# Altium schematic sheet camera.SchDoc
size A4; SheetNumber: 5; SheetTotal: 6
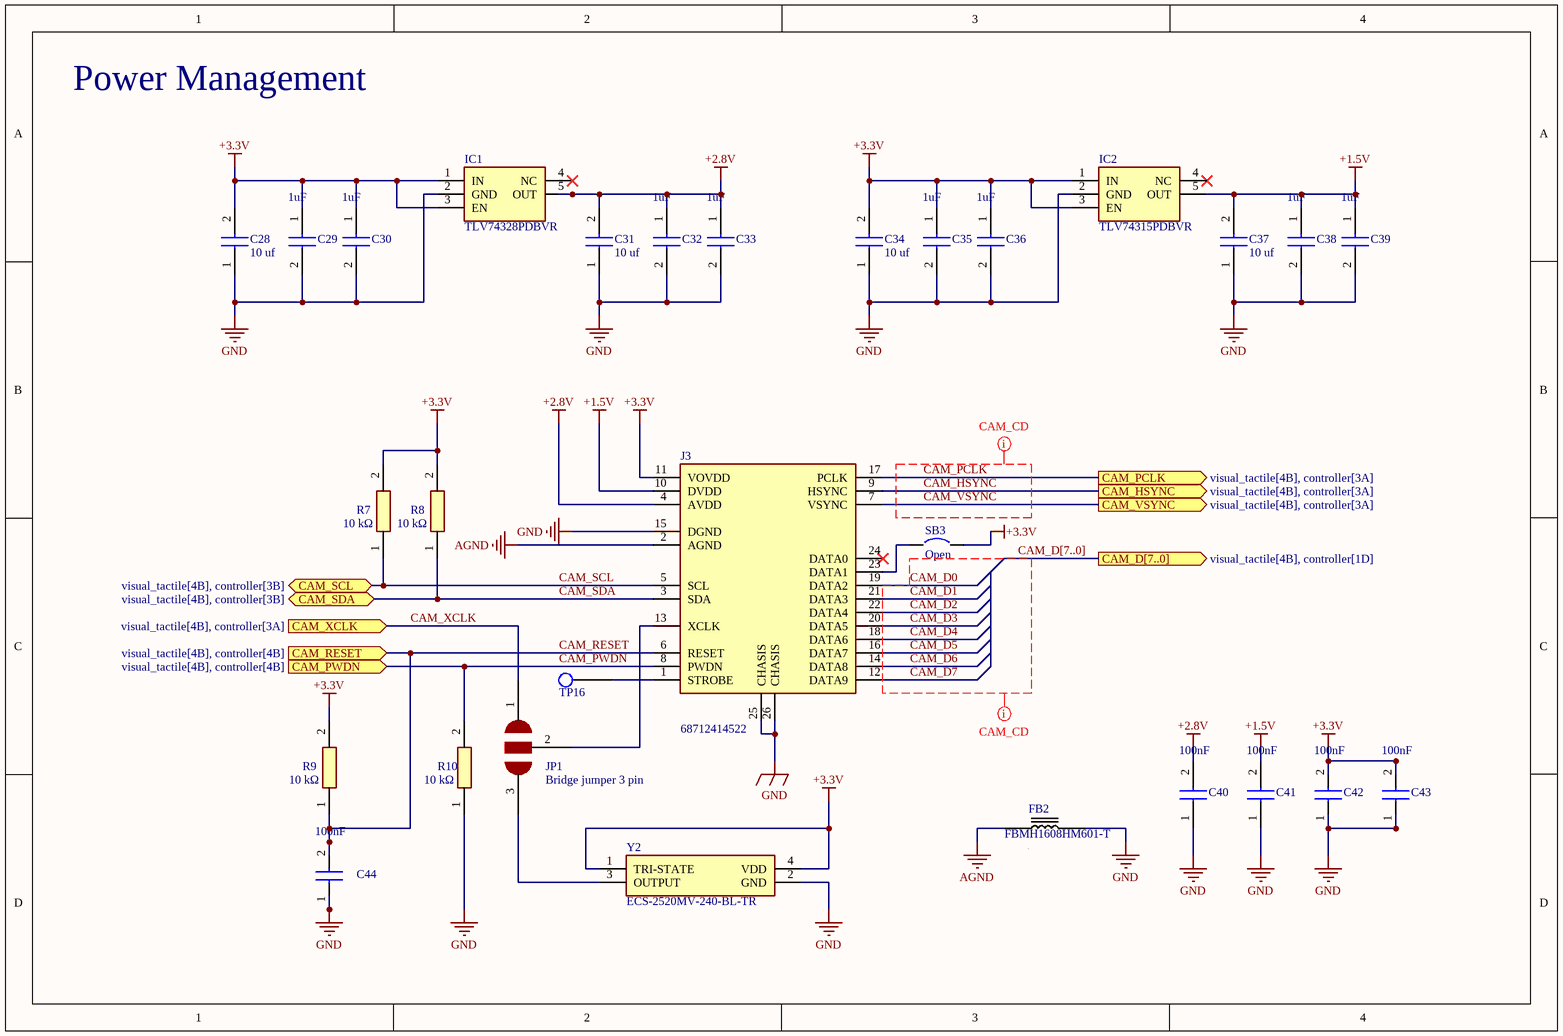
[diagram p0: camera.SchDoc]

## Parts
C28  10 uf  [CAPC1608X87N]
C29  value 1uF  [CAPC1608X87N]  (hidden comment: 0603ZD105KAT2A)
C30  value 1uF  [CAPC1608X87N]  (hidden comment: 0603ZD105KAT2A)
C31  10 uf  [CAPC1608X87N]
C32  value 1uF  [CAPC1608X87N]  (hidden comment: 0603ZD105KAT2A)
C33  value 1uF  [CAPC1608X87N]  (hidden comment: 0603ZD105KAT2A)
C34  10 uf  [CAPC1608X87N]
C35  value 1uF  [CAPC1608X87N]  (hidden comment: 0603ZD105KAT2A)
C36  value 1uF  [CAPC1608X87N]  (hidden comment: 0603ZD105KAT2A)
C37  10 uf  [CAPC1608X87N]
C38  value 1uF  [CAPC1608X87N]  (hidden comment: 0603ZD105KAT2A)
C39  value 1uF  [CAPC1608X87N]  (hidden comment: 0603ZD105KAT2A)
C40  value 100nF  [CAPC1608X87N]  (hidden comment: CGA3E2X7R1H104K080AA)
C41  value 100nF  [CAPC1608X87N]  (hidden comment: CGA3E2X7R1H104K080AA)
C42  value 100nF  [CAPC1608X87N]  (hidden comment: CGA3E2X7R1H104K080AA)
C43  value 100nF  [CAPC1608X87N]  (hidden comment: CGA3E2X7R1H104K080AA)
C44  value 100nF  [CAPC1608X87N]  (hidden comment: CGA3E2X7R1H104K080AA)
FB2  FBMH1608HM601-T  [BEADC1608X90N]
IC1  TLV74328PDBVR  [SOT95P280X145-5N]
IC2  TLV74315PDBVR  [SOT95P280X145-5N]
J3  68712414522  [68712414522]
JP1  Bridge jumper 3 pin  [Bridge jumper 3 pin]
R7  10 kΩ  [RESC1005X35N]
R8  10 kΩ  [RESC1005X35N]
R9  10 kΩ  [RESC1005X35N]
R10  10 kΩ  [RESC1005X35N]
SB3  Open  [SB_0603]
TP16  Test point  [test point]  (value not drawn)
Y2  ECS-2520MV-240-BL-TR  [ECS2520MV120BNTR]

## Ports
CAM_D[7..0] (out, see visual_tactile[4B], controller[1D]), CAM_HSYNC (out, see visual_tactile[4B], controller[3A]), CAM_PCLK (out, see visual_tactile[4B], controller[3A]), CAM_PWDN (in, see visual_tactile[4B], controller[4B]), CAM_RESET (in, see visual_tactile[4B], controller[4B]), CAM_SCL (bidir, see visual_tactile[4B], controller[3B]), CAM_SDA (bidir, see visual_tactile[4B], controller[3B]), CAM_VSYNC (out, see visual_tactile[4B], controller[3A]), CAM_XCLK (in, see visual_tactile[4B], controller[3A])

## Nets
+1.5V: C37.2 C38.1 C39.1 C41.2 IC2.5(OUT) J3.10(DVDD)
+2.8V: C31.2 C32.1 C33.1 C40.2 IC1.5(OUT) J3.4(AVDD)
+3.3V: C28.2 C29.1 C30.1 C34.2 C35.1 C36.1 C42.2 C43.2 IC1.1(IN) IC1.3(EN) IC2.1(IN) IC2.3(EN) J3.11(VOVDD) R7.2 R8.2 R9.2 SB3.2 Y2.1(TRI-STATE) Y2.4(VDD)
AGND: FB2.1 J3.2(AGND)
GND: C28.1 C29.2 C30.2 C31.1 C32.2 C33.2 C34.1 C35.2 C36.2 C37.1 C38.2 C39.2 C40.1 C41.1 C42.1 C43.1 C44.1 FB2.2 IC1.2(GND) IC2.2(GND) J3.15(DGND) J3.25(CHASIS) J3.26(CHASIS) R10.1 Y2.2(GND)
CAM_D0: J3.19(DATA2)
CAM_D1: J3.21(DATA3)
CAM_D2: J3.22(DATA4)
CAM_D3: J3.20(DATA5)
CAM_D4: J3.18(DATA6)
CAM_D5: J3.16(DATA7)
CAM_D6: J3.14(DATA8)
CAM_D7: J3.12(DATA9)
CAM_HSYNC: J3.9(HSYNC) ; port CAM_HSYNC
CAM_PCLK: J3.17(PCLK) ; port CAM_PCLK
CAM_PWDN: J3.8(PWDN) R10.2 ; port CAM_PWDN
CAM_RESET: C44.2 J3.6(RESET) R9.1 ; port CAM_RESET
CAM_SCL: J3.5(SCL) R7.1 ; port CAM_SCL
CAM_SDA: J3.3(SDA) R8.1 ; port CAM_SDA
CAM_VSYNC: J3.7(VSYNC) ; port CAM_VSYNC
CAM_XCLK: JP1.1 ; port CAM_XCLK
NetJ3_1: J3.1(STROBE) TP16.1
NetJ3_13: J3.13(XCLK) JP1.2
NetJ3_23: J3.23(DATA1) SB3.1
NetJP1_3: JP1.3 Y2.3(OUTPUT)

Not connected (* = marked no-connect by the designer): IC1 4(NC)*; IC2 4(NC)*; J3 24(DATA0)*

## Buses and harness runs
bus CAM_D[7..0] = port CAM_D[7..0]

## Layout directives
net class CAM_CD: CAM_D0, CAM_D1, CAM_D2, CAM_D3, CAM_D4, CAM_D5, CAM_D6, CAM_D7, CAM_D[7..0], CAM_HSYNC, CAM_PCLK, CAM_VSYNC

## Notes on the sheet
- Power Management

## Library data of the parts
C28 C31 C34 C37 = C0603C300J5GACTU: Ceramic Capacitor, Multilayer, Ceramic, 10V, 10% +Tol, 10% -Tol, X5R, 15% TC, 10uF, Surface Mount, 0603; Manufacturer_Name: KEMET; Value: 30pF; Multilayer: Yes; Tolerance  (fill in as +-): 5%; Rated DC Voltage (URdc): 50V; Temperature Characteristics Code: C0G; Datasheet Link: https://content.kemet.com/datasheets/KEM_C1003_C0G_SMD.pdf; Height: 0.87mm; Manufacturer_Part_Number: C0603C300J5GACTU; Mouser Part Number: 80-C0603C300J5G; Mouser Price/Stock: https://www.mouser.co.uk/ProductDetail/KEMET/C0603C300J5GACTU?qs=KQYYlyH3z3RpeXhtJmCcMA%3D%3D; Arrow Part Number: C0603C300J5GACTU; Arrow Price/Stock: https://www.arrow.com/en/products/c0603c300j5gactu/kemet-corporation; Supplier: Mouser; Supplier Part Number: 80-C0603C300J5G; Manufacturer: KEMET; Manufacturer Part Number: C0603C300J5GACTU; RoHS: Yes; Category: Ceramic Capacitors; Stock: 135157; Pricing: 1=0.1, 10=0.032, 50=0.032, 100=0.016, 1000=0.011, 10000=0.008 (USD); Mounting Technology: Surface Mount; Pins: 2; Dielectric Material: Ceramic; Package Shape: Rectangular; Case/Package: 0603; Terminal Finish: Nickel; Min Operating Temperature: -55°C; Max Operating Temperature: 125°C; JESD-609 Code: e3; Capacitor Type: Ceramic; Package Style: SMTMeter; Packaging: Tape and Reel; Tolerance (fill in as +-): 5%; Termination: Wraparound; Length: 1.6mm; Width: 0.8mm; Reach SVHC Compliant: Yes; RoHS Compliant: Yes; ComponentLink1URL: https://datasheet.ciiva.com:443/pdfs/VipMasterIC/IC/KEME/KEME-S-A0005605168/KEME-S-A0005605168-1.pdf?src-supplier=IHS+Markit; ComponentLink1Description: https://datasheet.ciiva.com:443/pdfs/VipMasterIC/IC/KEME/KEME-S-A0005605168/KEME-S-A0005605168-1.pdf?src-supplier=IHS+Markit; ComponentLink2URL: https://datasheet.ciiva.com/22700/1691965-22700853.pdf?src-supplier=Element14; ComponentLink2Description: https://datasheet.ciiva.com/22700/1691965-22700853.pdf?src-supplier=Element14; ComponentLink3URL: https://datasheet.ciiva.com/5420/kem-c1003-c0g-smd-356956-5420875.pdf?src-supplier=Mouser; ComponentLink3Description: https://datasheet.ciiva.com/5420/kem-c1003-c0g-smd-356956-5420875.pdf?src-supplier=Mouser; ComponentLink4URL: https://datasheet.ciiva.com:443/pdfs/VipMasterIC/IC/TDKC/TDKC-S-A0008796792/TDKC-S-A0008796792-1.pdf?src-supplier=IHS+Markit; ComponentLink4Description: https://datasheet.ciiva.com:443/pdfs/VipMasterIC/IC/TDKC/TDKC-S-A0008796792/TDKC-S-A0008796792-1.pdf?src-supplier=IHS+Markit
C29 C30 C32 C33 C35 C36 C38 C39 = C0603C300J5GACTU: Ceramic Capacitor, Multilayer, Ceramic, 10V, 10% +Tol, 10% -Tol, X5R, 15% TC, 1uF, Surface Mount, 0603; Manufacturer_Name: KEMET; Manufacturer: Kyocera AVX; Multilayer: Yes; Datasheet Link: https://content.kemet.com/datasheets/KEM_C1003_C0G_SMD.pdf; Height: 0.87mm; Manufacturer_Part_Number: C0603C300J5GACTU; Mouser Part Number: 80-C0603C300J5G; Mouser Price/Stock: https://www.mouser.co.uk/ProductDetail/KEMET/C0603C300J5GACTU?qs=KQYYlyH3z3RpeXhtJmCcMA%3D%3D; Arrow Part Number: C0603C300J5GACTU; Arrow Price/Stock: https://www.arrow.com/en/products/c0603c300j5gactu/kemet-corporation; Supplier: Arrow Electronics; Supplier Part Number: 0603ZD105KAT2A; Manufacturer Part Number: 0603ZD105KAT2A; RoHS: Yes; Category: Ceramic Capacitors; Stock: 612000; Pricing: 4000=0.0155, 8000=0.014, 12000=0.0136, 20000=0.0135, 24000=0.0127, 100000=0.009 (USD); Mounting Technology: Surface Mount; Pins: 2; Dielectric Material: Ceramic; Package Shape: Rectangular; Case/Package: 0603; Terminal Finish: Nickel; Min Operating Temperature: -55°C; Max Operating Temperature: 85°C; JESD-609 Code: e3; Capacitor Type: Ceramic; Tolerance  (fill in as +-): 10%; Package Style: SMTMeter; Packaging: Tape and Reel; Tolerance (fill in as +-): 10%; Rated DC Voltage (URdc): 10V; Temperature Characteristics Code: X5R; Termination: Wraparound; Length: 1.6mm; Width: 0.81mm; Reach SVHC Compliant: Yes; RoHS Compliant: Yes; ComponentLink1URL: https://datasheet.ciiva.com:443/pdfs/VipMasterIC/IC/AVXC/AVXC-S-A0009640604/AVXC-S-A0009640604-1.pdf?src-supplier=IHS+Markit; ComponentLink1Description: https://datasheet.ciiva.com:443/pdfs/VipMasterIC/IC/AVXC/AVXC-S-A0009640604/AVXC-S-A0009640604-1.pdf?src-supplier=IHS+Markit; ComponentLink2URL: https://datasheet.ciiva.com/11787/0900766b80a45521-11787469.pdf?src-supplier=Rs; ComponentLink2Description: https://datasheet.ciiva.com/11787/0900766b80a45521-11787469.pdf?src-supplier=Rs; ComponentLink3URL: https://datasheet.ciiva.com/150/cx5r-150308.pdf?src-supplier=Digikey; ComponentLink3Description: https://datasheet.ciiva.com/150/cx5r-150308.pdf?src-supplier=Digikey; ComponentLink4URL: https://datasheet.ciiva.com/150/cx5r-150309.pdf?src-supplier=Digikey; ComponentLink4Description: https://datasheet.ciiva.com/150/cx5r-150309.pdf?src-supplier=Digikey; ComponentLink5URL: https://datasheet.ciiva.com/150/cx5r-150310.pdf?src-supplier=Digikey; ComponentLink5Description: https://datasheet.ciiva.com/150/cx5r-150310.pdf?src-supplier=Digikey; ComponentLink6URL: https://datasheet.ciiva.com/6128/84508-6128747.pdf?src-supplier=Farnell; ComponentLink6Description: https://datasheet.ciiva.com/6128/84508-6128747.pdf?src-supplier=Farnell; ComponentLink7URL: https://datasheet.ciiva.com/11462/cx5r-11462907.pdf?src-supplier=Avnet; ComponentLink7Description: https://datasheet.ciiva.com/11462/cx5r-11462907.pdf?src-supplier=Avnet; ComponentLink8URL: https://datasheet.ciiva.com/2987/cx5r-2987907.pdf?src-supplier=Avnet; ComponentLink8Description: https://datasheet.ciiva.com/2987/cx5r-2987907.pdf?src-supplier=Avnet; ComponentLink9URL: https://datasheet.ciiva.com/16200/cx5r-16200364.pdf?src-supplier=Future+Electronics; ComponentLink9Description: https://datasheet.ciiva.com/16200/cx5r-16200364.pdf?src-supplier=Future+Electronics; ComponentLink10URL: https://datasheet.ciiva.com/14604/70001028-14604907.pdf?src-supplier=Allied+Electronics; ComponentLink10Description: https://datasheet.ciiva.com/14604/70001028-14604907.pdf?src-supplier=Allied+Electronics; ComponentLink11URL: https://datasheet.ciiva.com/1458/1666675-1458205.pdf?src-supplier=Element14; ComponentLink11Description: https://datasheet.ciiva.com/1458/1666675-1458205.pdf?src-supplier=Element14; ComponentLink12URL: https://datasheet.ciiva.com/1458/1666675-1458206.pdf?src-supplier=Element14; ComponentLink12Description: https://datasheet.ciiva.com/1458/1666675-1458206.pdf?src-supplier=Element14; ComponentLink13URL: https://datasheet.ciiva.com/1458/84508-1458207.pdf?src-supplier=Element14; ComponentLink13Description: https://datasheet.ciiva.com/1458/84508-1458207.pdf?src-supplier=Element14; ComponentLink14URL: https://datasheet.ciiva.com/7855/1666675-7855113.pdf?src-supplier=Element14; ComponentLink14Description: https://datasheet.ciiva.com/7855/1666675-7855113.pdf?src-supplier=Element14
C40-C44 = C0603C300J5GACTU: Ceramic Capacitor, Multilayer, Ceramic, 50V, 10% +Tol, 10% -Tol, X7R, 15% TC, 0.1uF, Surface Mount, 0603; Manufacturer_Name: KEMET; Manufacturer: TDK; Multilayer: Yes; Reference Standard: AEC-Q200; Datasheet Link: https://content.kemet.com/datasheets/KEM_C1003_C0G_SMD.pdf; Height: 0.87mm; Manufacturer_Part_Number: C0603C300J5GACTU; Mouser Part Number: 80-C0603C300J5G; Mouser Price/Stock: https://www.mouser.co.uk/ProductDetail/KEMET/C0603C300J5GACTU?qs=KQYYlyH3z3RpeXhtJmCcMA%3D%3D; Arrow Part Number: C0603C300J5GACTU; Arrow Price/Stock: https://www.arrow.com/en/products/c0603c300j5gactu/kemet-corporation; Supplier: Rs; Supplier Part Number: 7882985P; Manufacturer Part Number: CGA3E2X7R1H104K080AA; RoHS: Yes; Category: Ceramic Capacitors; Stock: 84850; Pricing: 250=0.042, 500=0.039, 1000=0.037, 2500=0.033 (EUR); Mounting Technology: Surface Mount; Pins: 2; Dielectric Material: Ceramic; Package Shape: Rectangular; Case/Package: 0603; Terminal Finish: Nickel; Min Operating Temperature: -55°C; Max Operating Temperature: 125°C; JESD-609 Code: e3; Capacitor Type: Ceramic; Tolerance  (fill in as +-): 10%; Package Style: SMTMeter; Packaging: Tape and Reel; Tolerance (fill in as +-): 10%; Rated DC Voltage (URdc): 50V; Temperature Characteristics Code: X7R; Termination: Wraparound; Length: 1.6mm; Width: 0.8mm; Reach SVHC Compliant: Yes; RoHS Compliant: Yes; ComponentLink1URL: https://datasheet.ciiva.com:443/pdfs/VipMasterIC/IC/TDKC/TDKC-S-A0008953915/TDKC-S-A0008953915-1.pdf?src-supplier=IHS+Markit; ComponentLink1Description: https://datasheet.ciiva.com:443/pdfs/VipMasterIC/IC/TDKC/TDKC-S-A0008953915/TDKC-S-A0008953915-1.pdf?src-supplier=IHS+Markit
FB2 = FBMH1608HM601-T: Ferrite Bead; Manufacturer_Name: TAIYO YUDEN; Datasheet Link: https://componentsearchengine.com/Datasheets/2/FBMH1608HM601-T.pdf; Height: 0.9mm; Manufacturer_Part_Number: FBMH1608HM601-T; Mouser Part Number: 963-FBMH1608HM601-T; Mouser Price/Stock: https://www.mouser.co.uk/ProductDetail/Taiyo-Yuden/FBMH1608HM601-T?qs=I6KAKw0tg2y6O4cu0afp%252BA%3D%3D; Arrow Part Number: FBMH1608HM601-T; Arrow Price/Stock: https://www.arrow.com/en/products/fbmh1608hm601-t/taiyo-yuden
IC1 = TLV74328PDBVR: Integrated Circuit; Manufacturer_Name: Texas Instruments; Datasheet Link: http://www.ti.com/lit/gpn/tlv743p; Height: 1.45mm; Manufacturer_Part_Number: TLV74328PDBVR; Mouser Part Number: 595-TLV74328PDBVR; Mouser Price/Stock: https://www.mouser.co.uk/ProductDetail/Texas-Instruments/TLV74328PDBVR?qs=EU6FO9ffTwcPVi1bAnm%2FxQ%3D%3D; Arrow Part Number: TLV74328PDBVR; Arrow Price/Stock: https://www.arrow.com/en/products/tlv74328pdbvr/texas-instruments
IC2 = TLV74315PDBVR: Integrated Circuit; Manufacturer_Name: Texas Instruments; Datasheet Link: http://www.ti.com/lit/gpn/tlv743p; Height: 1.45mm; Manufacturer_Part_Number: TLV74315PDBVR; Mouser Part Number: 595-TLV74315PDBVR; Mouser Price/Stock: https://www.mouser.com/Search/Refine.aspx?Keyword=595-TLV74315PDBVR; Arrow Part Number: TLV74315PDBVR; Arrow Price/Stock: https://www.arrow.com/en/products/tlv74315pdbvr/texas-instruments
J3 = 68712414522: Connector; Manufacturer_Name: Wurth Elektronik; Datasheet Link: http://katalog.we-online.com/em/datasheet/6871xx14522.pdf; Height: 2mm; Manufacturer_Part_Number: 68712414522; Mouser Part Number: 710-68712414522; Mouser Price/Stock: https://www.mouser.co.uk/ProductDetail/Wurth-Elektronik/68712414522?qs=gQDq3jdaPP%252BItTj8tkqRTw%3D%3D
R7-R10 = CPF0402B100KE: Resistor; Manufacturer_Name: TE Connectivity; Datasheet Link: http://www.farnell.com/datasheets/1786775.pdf; Height: 0.35mm; Manufacturer_Part_Number: CPF0402B100KE; Mouser Part Number: 279-CPF0402B100KE; Mouser Price/Stock: https://www.mouser.co.uk/ProductDetail/TE-Connectivity-Holsworthy/CPF0402B100KE?qs=CXI0wBT1M2h4W2Gm72yIGA%3D%3D; Arrow Part Number: CPF0402B100KE; Arrow Price/Stock: https://www.arrow.com/en/products/cpf0402b100ke/te-connectivity?region=nac
SB3 = Circuit Breaker: Published: 24-Mar-1999; Revision: July-2002: Re-released for DXP Platform.; Publisher: Altium Limited
Y2 = ECS-2520MV-240-BL-TR: Crystal or Oscillator; Manufacturer_Name: ECS; Manufacturer_Part_Number: ECS-2520MV-120-BN-TR; Datasheet Link: https://componentsearchengine.com/Datasheets/1/ECS-2520MV-120-BN-TR.pdf; Height: 0.9mm; Mouser Part Number: 520-2520MV-120-BN-T; Mouser Price/Stock: https://www.mouser.co.uk/ProductDetail/ECS/ECS-2520MV-120-BN-TR?qs=fAHHVMwC%252BbguRJeb0QafEw%3D%3D; Arrow Part Number: ECS-2520MV-120-BN-TR; Arrow Price/Stock: https://www.arrow.com/en/products/ecs-2520mv-120-bn-tr/ecs-international?region=nac